# EAGLE schematic LSM303_breakout_board-v12 (EAGLE 6.1)
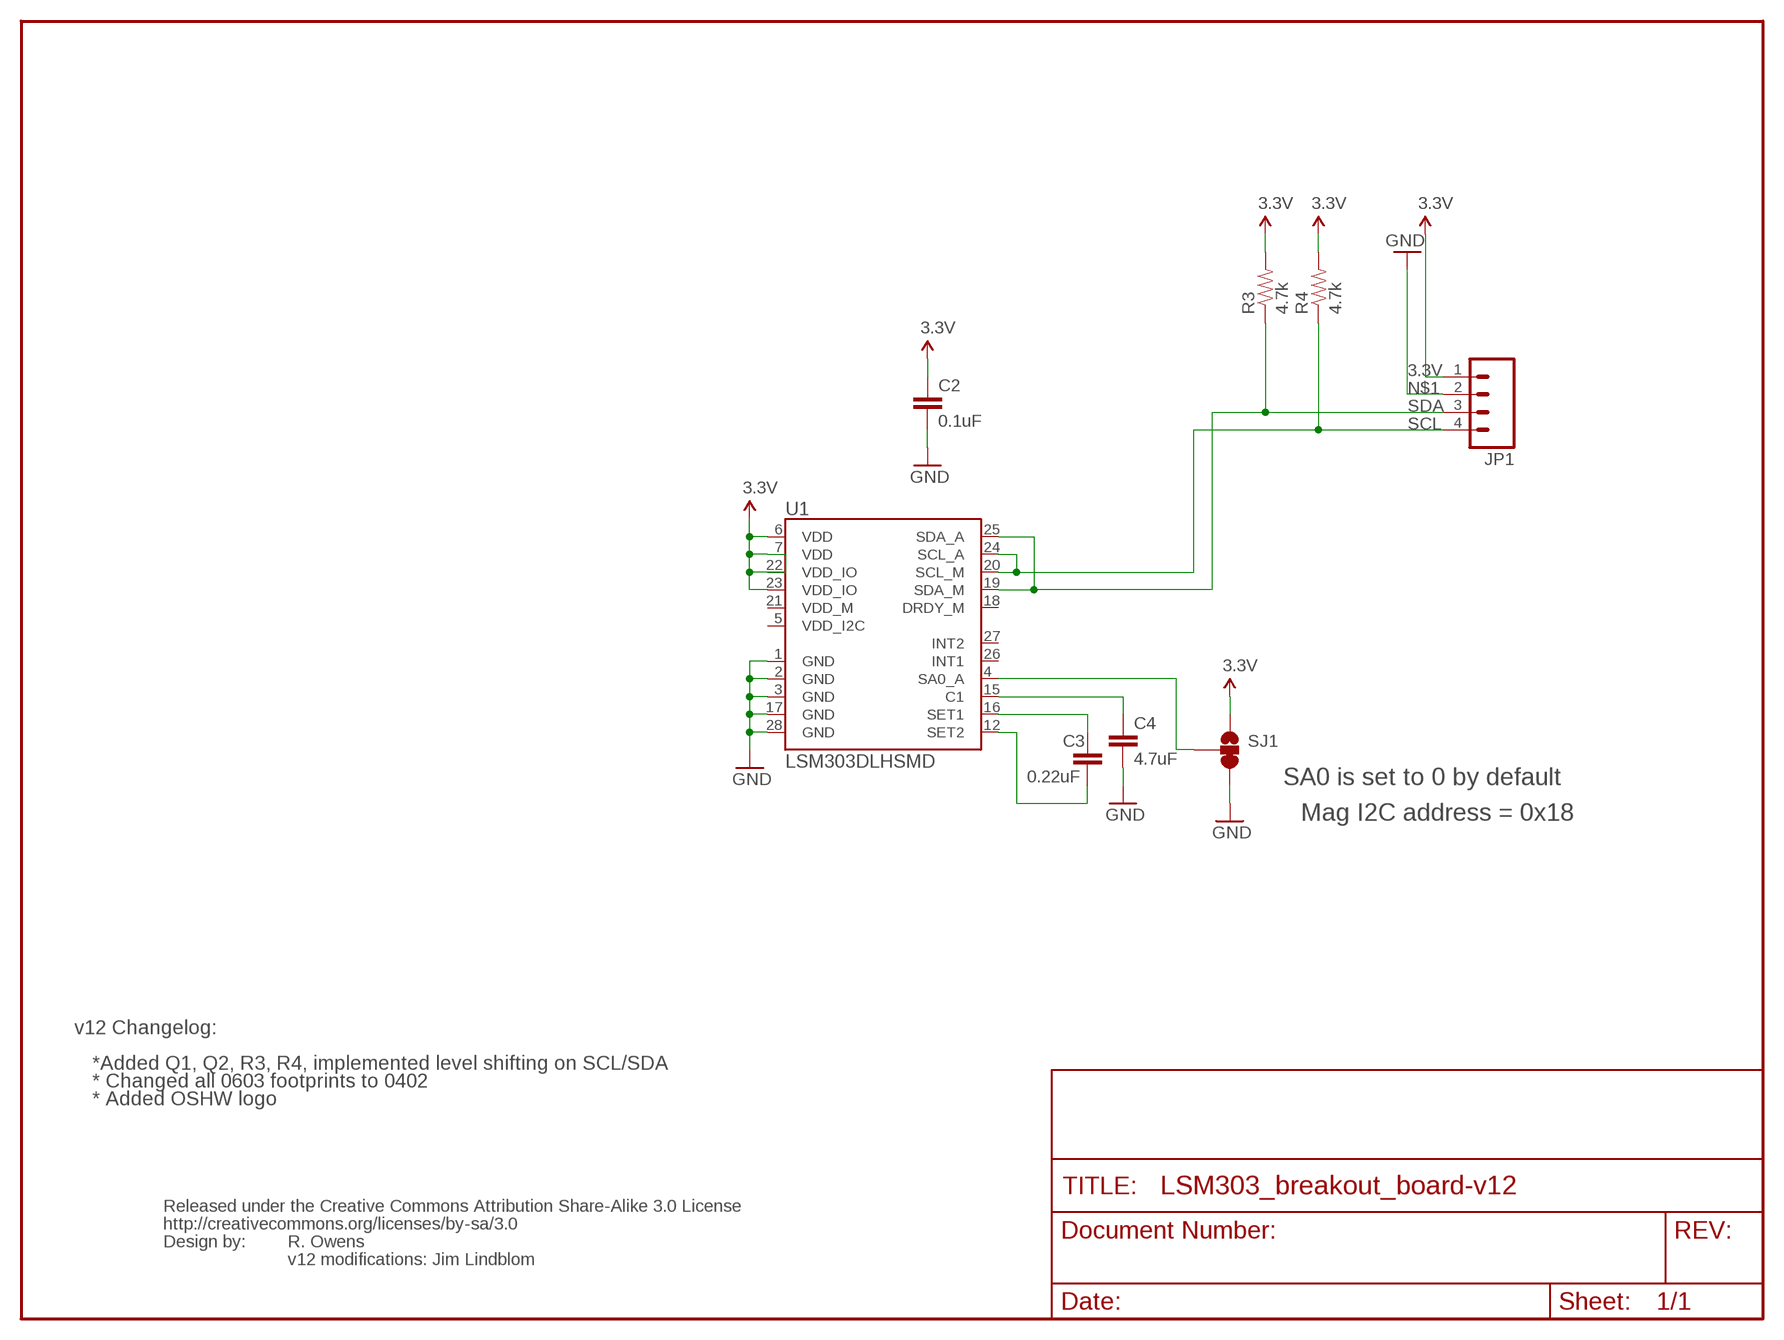
[diagram p0: schematic, sheet 1]

## Parts
C2  0.1uF  CAP0603-CAP  [0603-CAP]
C3  0.22uF  CAP0603-CAP  [0603-CAP]
C4  4.7uF  CAP1206  [1206]
JP1  M04PTH  [1X04]
R3  4.7k  RESISTOR0603-RES  [0603-RES]
R4  4.7k  RESISTOR0603-RES  [0603-RES]
SJ1  SOLDERJUMPER_2WAYPASTE2&3  [SJ_3_PASTE2&3]
U1  LSM303DLHSMD  [LGA28-5X5]
U$5  CREATIVE_COMMONS  [CREATIVE_COMMONS]

## Nets
3.3V: C2.1 JP1.1 R3.2 R4.2 SJ1.1 U1.6(VDD) U1.7(VDD) U1.23(VDD_IO)
N$1: C2.2 C4.2 JP1.2 SJ1.3 U1.1(GND) U1.2(GND) U1.3(GND) U1.17(GND) U1.28(GND) ; supply symbol labelled GND
N$10: C3.1 U1.16(SET1)
N$11: C3.2 U1.12(SET2)
N$12: C4.1 U1.15(C1)
SA0_A: SJ1.2 U1.4(SA0_A)
SCL: JP1.4 R4.1 U1.20(SCL_M) U1.24(SCL_A)
SDA: JP1.3 R3.1 U1.19(SDA_M) U1.25(SDA_A)
Unconnected: U1.5(VDD_I2C) U1.18(DRDY_M) U1.21(VDD_M) U1.22(VDD_IO) U1.26(INT1) U1.27(INT2)

## Notes on the sheet
- SA0 is set to 0 by default
- Mag I2C address = 0x18
- v12 Changelog:
- *Added Q1, Q2, R3, R4, implemented level shifting on SCL/SDA
- * Changed all 0603 footprints to 0402
- * Added OSHW logo
- R. Owens
- v12 modifications: Jim Lindblom

## Library data of the parts
C2-C4 = SparkFun:CAP: Capacitor Standard 0603 ceramic capacitor, and 0.1" leaded capacitor.
JP1 = SparkFun-Connectors:M04: Header 4 Standard 4-pin 0.1" header. Use with straight break away headers (SKU : PRT-00116), right angle break away headers (PRT-00553), swiss pins (PRT-00743), machine pins (PRT-00117), and female headers (PRT-00115). Molex polarized connector foot print use with SKU : PRT-08231 with associated crimp pins and housings. 1MM SMD Version SKU: PRT-10208
R3 R4 = SparkFun:RESISTOR: Resistor Basic schematic elements and footprints for 0603, 1206, and PTH resistors.
SJ1 = SparkFun:SOLDERJUMPER_2WAY: Solder Jumper 2 way solder jumper
U1 = SparkFun:LSM303DLH
U$5 = SparkFun:CREATIVE_COMMONS